# Altium schematic sheet HighCurrentDriver.SchDoc
size A4
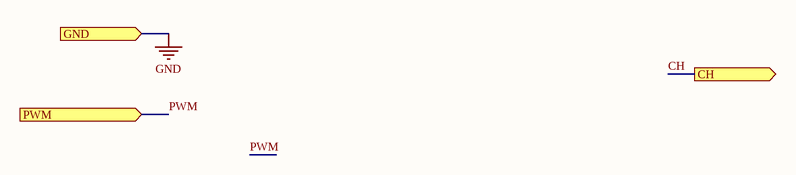
[diagram p0: HighCurrentDriver.SchDoc]

## Ports
CH (out), GND (in), PWM (in)

## Nets
GND: port GND
CH: port CH
PWM: port PWM